# EAGLE design module-si7021-mpl3115 (EAGLE 7.4.0)
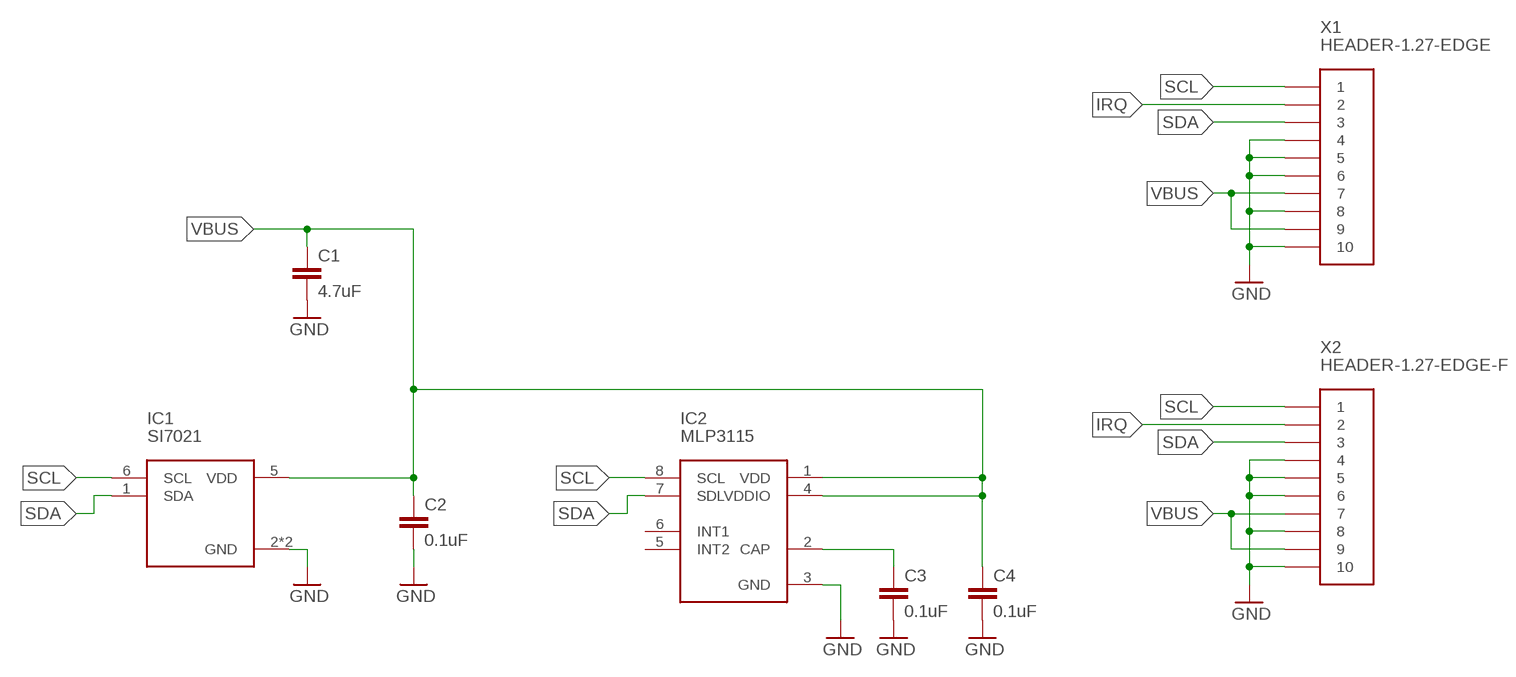
[diagram p0: schematic, sheet 1]

## Parts
C1  4.7uF  C-EUC0805  [C0805]
C2  0.1uF  C-EUC0603  [C0603]
C3  0.1uF  C-EUC0603  [C0603]
C4  0.1uF  C-EUC0603  [C0603]
IC1  SI7021  [DFN6-3X3]
IC2  MLP3115  [LGA8-3X3X1.25]
X1  HEADER-1.27-EDGE  [HEADER-1.27-EDGE]
X2  HEADER-1.27-EDGE-F  [HEADER-1.27-EDGE-F]

## Nets
GND: C1.2 C2.2 C3.2 C4.2 IC1.2(GND) IC1.PAD(GND) IC2.3(GND) X1.4 X1.5 X1.6 X1.8 X1.10 X2.4 X2.5 X2.6 X2.8 X2.10
IRQ: X1.2 X2.2
N$2: C3.1 IC2.2(CAP)
SCL: IC1.6(SCL) IC2.8(SCL) X1.1 X2.1
SDA: IC1.1(SDA) IC2.7(SDL) X1.3 X2.3
VBUS: C1.1 C2.1 C4.1 IC1.5(VDD) IC2.1(VDD) IC2.4(VDDIO) X1.7 X1.9 X2.7 X2.9
Unconnected: IC2.5(INT2) IC2.6(INT1)

## Library data of the parts
C1-C4 = rcl:C-EU: CAPACITOR, European symbol
IC1 = temp-hum-pressure:SI7021
IC2 = temp-hum-pressure:MLP3115
X1 = con-headers:HEADER-1.27-EDGE
X2 = con-headers:HEADER-1.27-EDGE-F

## Board
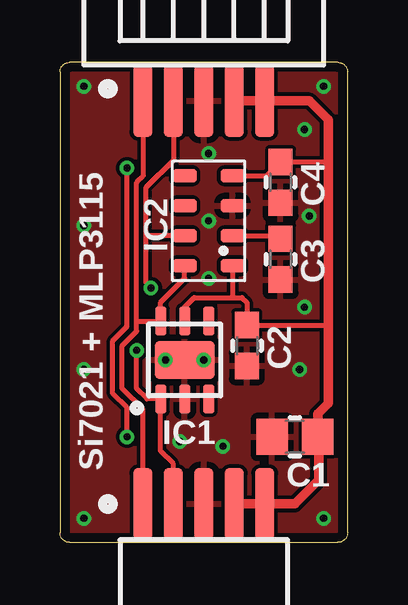
[diagram p1: board, top side]
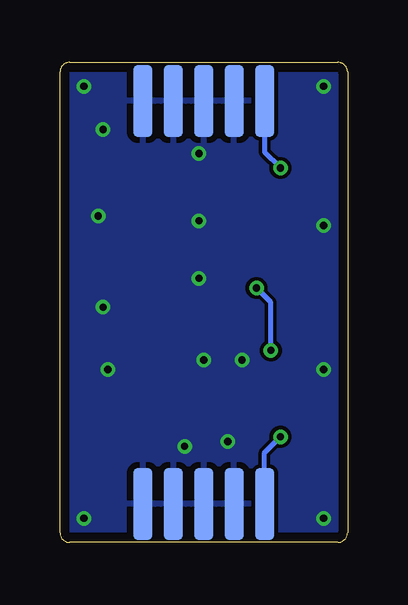
[diagram p2: board, bottom side, seen from below]

Size 12 x 20 mm. Coordinates in mm from the lower left corner, seen from the top.
Outline: 0.4,0 11.6,0 arc90 12,0.4 12,19.6 arc90 11.6,20 0.4,20 arc90 0,19.6 0,0.4 arc90 0.4,0
Copper layers (1*16): Top 0.035mm / dielectric 1.5mm / Bottom 0.035mm
Design rules "seeed": minimum track width 0.2mm, minimum drill 0.3mm, track to track 0.15mm, track to pad 0.15mm, pad to pad 0.15mm, via to via 0.15mm, smd to smd 0mil, copper to edge 0.4mm, drill to drill 0.4mm, minimum pad ring 6mil, minimum via ring 6mil, stop-mask expansion 2mil, vias tented up to drill 0.5mm, thermal gap 10mil

### Footprints (pad centres in the part's own frame; a part is rotated, then mirrored left to right if it is on the bottom)
C0805 = smd 1.3 x 1.5: 1 -0.95,0; 2 0.95,0
C0603 = smd 1.1 x 1: 1 -0.85,0; 2 0.85,0
DFN6-3X3 = smd 0.45 x 1.2: 1 -1,-1.625; 2 0,-1.625; 3 1,-1.625; 4 1,1.625; 5 0,1.625; 6 -1,1.625 | smd 2.5 x 1.6: PAD 0,0
LGA8-3X3X1.25 = smd 1 x 0.55: 1 -1,1.875; 2 -1,0.625; 3 -1,-0.625; 4 -1,-1.875; 5 1,-1.875; 6 1,-0.625; 7 1,0.625; 8 1,1.875
HEADER-1.27-EDGE = smd 0.8 x 3: 1 2.54,0; 3 1.27,0; 5 0,0; 7 -1.27,0; 9 -2.54,0 | smd 0.8 x 3 bottom: 2 2.54,0; 4 1.27,0; 6 0,0; 8 -1.27,0; 10 -2.54,0
HEADER-1.27-EDGE-F = smd 0.8 x 3: 1 2.54,0; 3 1.27,0; 5 0,0; 7 -1.27,0; 9 -2.54,0 | smd 0.8 x 3 bottom: 2 2.54,0; 4 1.27,0; 6 0,0; 8 -1.27,0; 10 -2.54,0

### Placement (x,y rotation side)
C1  9.8,4.4 180 top
C2  7.8,8.2 270 top
C3  9.2,11.8 270 top
C4  9.2,15 270 top
IC1  5.2,7.6 0 top
IC2  6.2,13.4 180 top
X1  6,18.4 180 top
X2  6,1.6 180 top

### Tracks (layer width: path | path; a pad name or v marks a point on that pad's centre or on a via)
GND  (via drill 0.3)
  other vias: 1,1 11,1 10,7.2 1,7.2 1,13.2 10.4,13.6 1,19 11,19 6.8,4 5,4.2 10.2,9.8 4.4,7.6 6,7.6 10.2,17.2 6.2,11 6.2,13.4 6.2,16.2
  pour Top (rank 2): 0,0 12,0 12,20 0,20
  pour Bottom (rank 2): 0,0 12,0 12,20 0,20
IRQ  (via drill 0.3)
  Top 0.2: v2.8,4.4 2.8,5.6 2.2,6.2 2.2,8.4 2.8,9 v2.8,15.6
  Bottom 0.2: X2.2 3.46,3.74 v2.8,4.4 | v2.8,15.6 3.46,16.26 X1.2
N$2
  Top 0.2: IC2.2 9.07,12.78 C3.1
SCL
  Top 0.2: X1.1 3.46,15.26 3.2,15 3.2,9.2 | X2.1 3.46,5.54 2.6,6.4 2.6,8.2 3.2,8.8 3.2,9.2 | 3.2,9.2 4.17,9.2 IC1.6 4.2,10 5.2,11 IC2.8
SDA  (via drill 0.3)
  Top 0.2: X1.3 4.73,15.93 3.6,14.8 3.6,12.8 | X2.3 4.73,3.27 4.2,3.8 IC1.1 3.62,5.97 3.2,6.4 v3.2,8 | v3.8,10.6 3.6,10.8 3.6,12.8 | IC2.7 3.62,12.78 3.6,12.8
  Bottom 0.2: v3.2,8 3.2,10 v3.8,10.6
VBUS
  Top 0.2: IC1.5 5.2,9.8 5.6,10.2 7.2,10.2 | 7.2,10.2 7.6,10.2 7.8,10 C2.1 11.15,9.05 11.2,9 | IC2.1 7.2,10.2 | IC2.4 8.62,15.28 C4.1 11.15,15.85 11.2,15.8
  Top 0.4: X1.7 X1.9 10.4,18.4 11.2,17.6 11.2,15.8 11.2,9 11.2,5.8 10.75,5.35 C1.1 10.8,4.35 10.8,2.6 9.8,1.6 X2.9 X2.7

### Text on the board
tPlace: Si7021 + MLP3115